# EAGLE design octapentaveega_v2 (EAGLE 7.4.0)
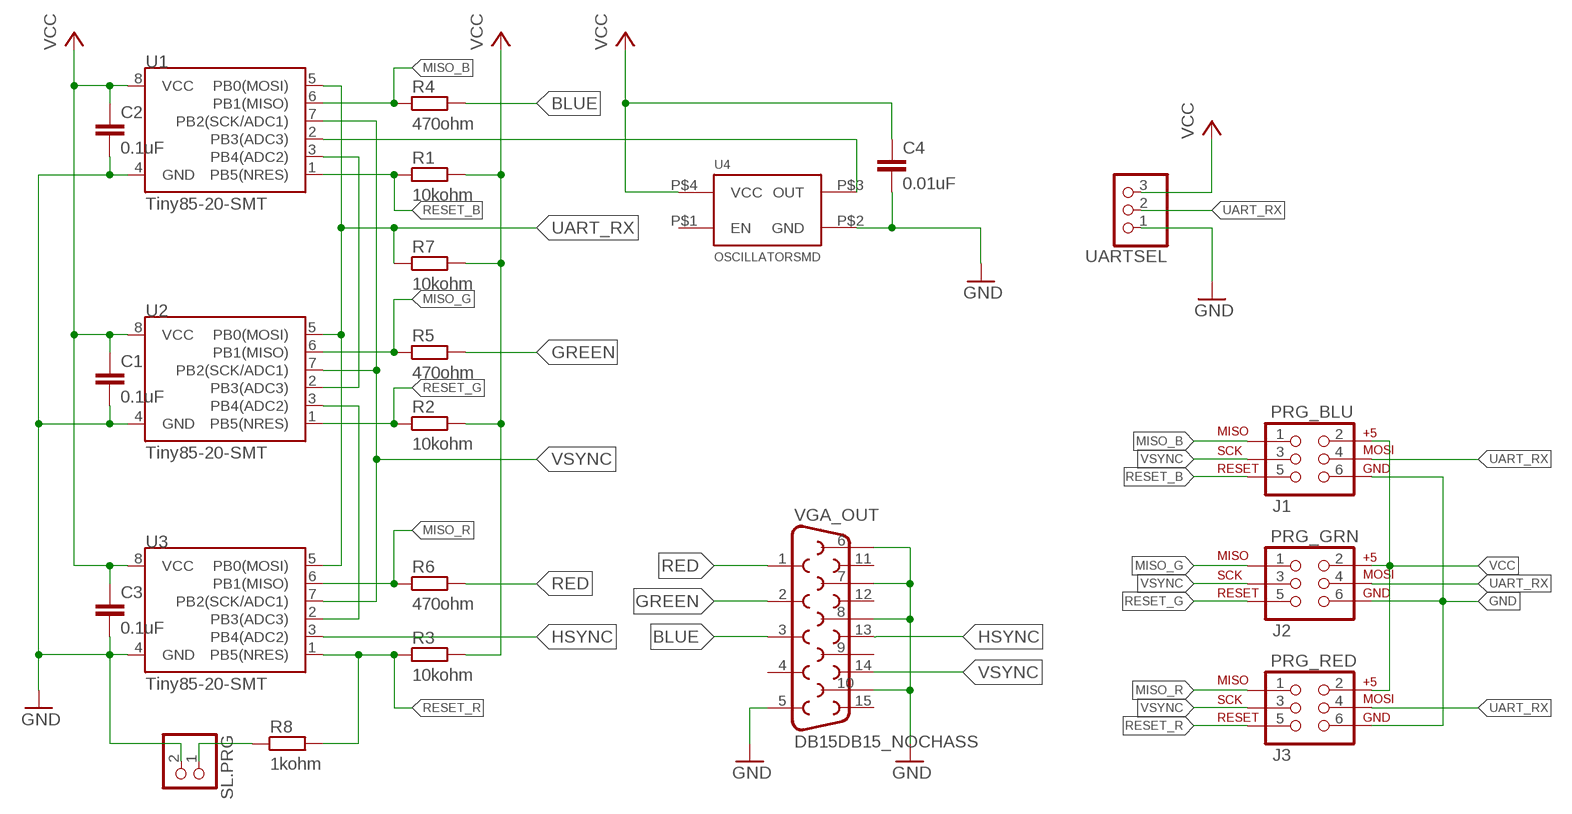
[diagram p0: schematic, sheet 1]

## Parts
C1  0.1uF  CAPACITOR  [C0603]
C2  0.1uF  CAPACITOR  [C0603]
C3  0.1uF  CAPACITOR  [C0603]
C4  0.01uF  CAPACITOR  [C0603]
PRG_BLU  J1  ISPTOUCH_HEADER  [AVX_9188_6-WAY_MATING_GUIDE]
PRG_GRN  J2  ISPTOUCH_HEADER  [AVX_9188_6-WAY_MATING_GUIDE]
PRG_RED  J3  ISPTOUCH_HEADER  [AVX_9188_6-WAY_MATING_GUIDE]
R1  10kohm  RESISTOR  [R0603]
R2  10kohm  RESISTOR  [R0603]
R3  10kohm  RESISTOR  [R0603]
R4  470ohm  RESISTOR  [R0603]
R5  470ohm  RESISTOR  [R0603]
R6  470ohm  RESISTOR  [R0603]
R7  10kohm  RESISTOR  [R0603]
R8  1kohm  RESISTOR  [R0603]
SL.PRG  PINHD-1X02_2.54-S  [1X02-S]
U1  Tiny85-20-SMT  ATTINY45TINY85-20-SMT  [SO08-EIAJ]
U2  Tiny85-20-SMT  ATTINY45TINY85-20-SMT  [SO08-EIAJ]
U3  Tiny85-20-SMT  ATTINY45TINY85-20-SMT  [SO08-EIAJ]
U4  OSCILLATORSMD  [CRYSTAL-SMD-7X5]
UARTSEL  PINHD-1X03_2.54-S  [1X03-S]
VGA_OUT  DB15DB15_NOCHASS  [DB15_NOCHASS]

## Nets
BLUE: R4.2 VGA_OUT.3
GND: C1.2 C2.2 C3.2 C4.2 PRG_BLU.6 PRG_GRN.6 PRG_RED.6 SL.PRG.2 U1.4(GND) U2.4(GND) U3.4(GND) U4.P$2(GND) UARTSEL.1 VGA_OUT.5 VGA_OUT.6 VGA_OUT.7 VGA_OUT.8 VGA_OUT.10
GREEN: R5.2 VGA_OUT.2
HSYNC: U3.3(PB4(ADC2)) VGA_OUT.13
MISO_B: PRG_BLU.1 R4.1 U1.6(PB1(MISO))
MISO_G: PRG_GRN.1 R5.1 U2.6(PB1(MISO))
MISO_R: PRG_RED.1 R6.1 U3.6(PB1(MISO))
N$1: U1.2(PB3(ADC3)) U4.P$3(OUT)
N$2: U1.3(PB4(ADC2)) U2.2(PB3(ADC3))
N$3: U2.3(PB4(ADC2)) U3.2(PB3(ADC3))
N$16: R8.1 SL.PRG.1
RED: R6.2 VGA_OUT.1
RESET_B: PRG_BLU.5 R1.1 U1.1(PB5(NRES))
RESET_G: PRG_GRN.5 R2.1 U2.1(PB5(NRES))
RESET_R: PRG_RED.5 R3.1 R8.2 U3.1(PB5(NRES))
UART_RX: PRG_BLU.4 PRG_GRN.4 PRG_RED.4 R7.1 U1.5(PB0(MOSI)) U2.5(PB0(MOSI)) U3.5(PB0(MOSI)) UARTSEL.2
VCC: C1.1 C2.1 C3.1 C4.1 PRG_BLU.2 PRG_GRN.2 PRG_RED.2 R1.2 R2.2 R3.2 R7.2 U1.8(VCC) U2.8(VCC) U3.8(VCC) U4.P$4(VCC) UARTSEL.3
VSYNC: PRG_BLU.3 PRG_GRN.3 PRG_RED.3 U1.7(PB2(SCK/ADC1)) U2.7(PB2(SCK/ADC1)) U3.7(PB2(SCK/ADC1)) VGA_OUT.14
Unconnected: U4.P$1(EN) VGA_OUT.4 VGA_OUT.9 VGA_OUT.11 VGA_OUT.12 VGA_OUT.15

## Library data of the parts
C1-C4 = BaseApp:CAPACITOR
PRG_BLU PRG_GRN PRG_RED = prg_header:ISPTOUCH: ISPtouch for AVR Microcontrollers This 6-pin ISP connector for AVR programming does not require any part on the PCB, but an adapter for a common 6-pin programmer.
R1-R8 = BaseApp:RESISTOR: Resistance Package :- 0603 Mount :-Surface mount
SL.PRG = pinhead-2:PINHD-1X02: PIN HEADER
U1-U3 = SparkFun-DigitalIC:ATTINY45: Atmel 8-pin 2/4/8kB flash uC; PROD_ID: IC-09092
U4 = SparkFun-FreqCtrl:OSCILLATOR: Generic 5x3 and 7x5 oscillators
UARTSEL = pinhead-2:PINHD-1X03: PIN HEADER
VGA_OUT = SparkFun-Connectors:DB15: DB15 / VGA right angle through-hole female connector.

## Board
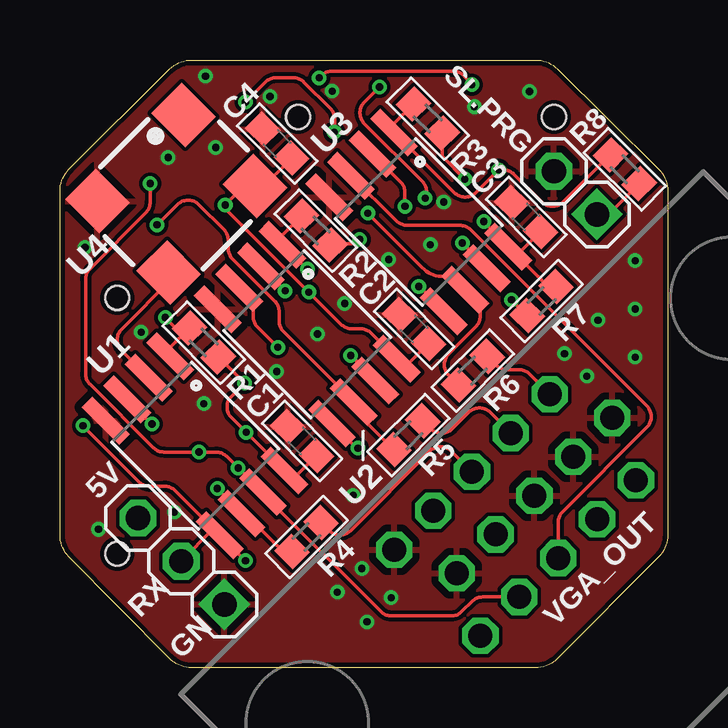
[diagram p1: board, top side]
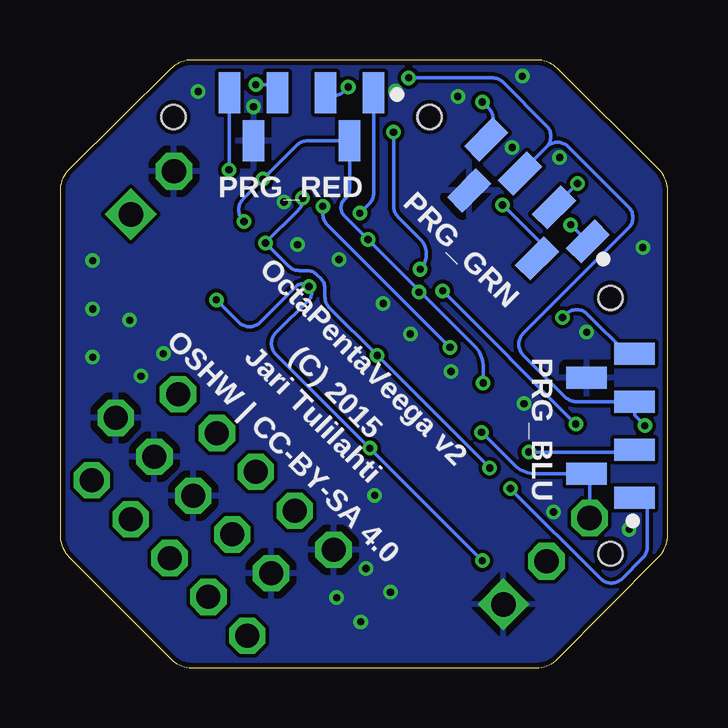
[diagram p2: board, bottom side, seen from below]

Size 25.32 x 25.32 mm. Coordinates in mm from the lower left corner, seen from the top.
Outline: 0.37,20.77 4.58,24.95 arc-45 5.48,25.32 19.82,25.32 arc-45 20.72,24.96 24.95,20.77 arc-45 25.32,19.87 25.32,5.53 arc-45 24.95,4.63 20.72,0.37 arc-45 19.82,0 5.48,0 arc-45 4.58,0.38 0.37,4.63 arc-45 0,5.53 0,19.87 arc-45 0.37,20.77
Copper layers (1*16): Top 0.035mm / dielectric 1.5mm / Bottom 0.035mm
Design rules "tagsu *": minimum track width 6mil, minimum drill 0.3mm, track to track 6mil, track to pad 6mil, pad to pad 6mil, via to via 6mil, smd to smd 0mil, copper to edge 0.2mm, drill to drill 0.2mm, minimum pad ring 10mil, minimum via ring 6mil, stop-mask expansion 2mil, vias tented up to drill 100mil, thermal gap 0.3mm

### Footprints (pad centres in the part's own frame; a part is rotated, then mirrored left to right if it is on the bottom)
C0603 = smd 1.1 x 1: 1 -0.85,0; 2 0.85,0
AVX_9188_6-WAY_MATING_GUIDE = smd 0.9 x 1.7: 1 -3,-1; 2 -2,1; 3 -1,-1; 4 1,-1; 5 3,-1; 6 2,1 | hole 1: -5.334,0; 5.334,0
R0603 = smd 1 x 1.1: 1 -0.85,0; 2 0.85,0
1X02-S = drill 1.016 square: 1 -1.27,0 | drill 1.016 octagon: 2 1.27,0
SO08-EIAJ = smd 0.61 x 2.21: 1 -1.905,-3.378; 2 -0.635,-3.378; 3 0.635,-3.378; 4 1.905,-3.378; 5 1.905,3.353; 6 0.635,3.353; 7 -0.635,3.353; 8 -1.905,3.353
CRYSTAL-SMD-7X5 = smd 1.8 x 2: P$1 -2.54,-2.1; P$2 2.54,-2.1; P$3 2.54,2.1; P$4 -2.54,2.1
1X03-S = drill 1.016 square: 1 -2.54,0 | drill 1.016 octagon: 2 0,0; 3 2.54,0
DB15_NOCHASS = drill 1 octagon: 1 -4.32,-7.62; 2 -2.03,-7.62; 3 0.26,-7.62; 4 2.55,-7.62; 5 4.84,-7.62; 6 -5.46,-5.08; 7 -3.17,-5.08; 8 -0.88,-5.08; 9 1.41,-5.08; 10 3.7,-5.08; 11 -4.32,-2.54; 12 -2.03,-2.54; 13 0.26,-2.54; 14 2.55,-2.54; 15 4.84,-2.54

### Placement (x,y rotation side)
C1  10.09,9.45 135 top
C2  14.76,14.12 135 top
C3  19.43,18.78 135 top
C4  9.05,21.84 135 top
PRG_BLU  2.38,10.09 90 bottom
PRG_GRN  6.16,19.18 135 bottom
PRG_RED  15.25,22.95 180 bottom
R1  5.99,13.55 315 top
R2  10.66,18.22 315 top
R3  15.32,22.88 315 top
R4  10.27,5.45 45 top
R5  14.51,9.69 45 top
R6  17.2,12.38 45 top
R7  20.07,15.28 45 top
R8  23.53,20.77 135 top
SL.PRG  21.47,19.79 135 top
U1  5.64,9.25 225 top
U2  10.31,13.89 225 top
U3  14.96,18.57 225 top
U4  4.84,19.76 225 top
UARTSEL  5.05,4.44 135 top
VGA_OUT  22.74,2.96 225 top

### Tracks (layer width: path | path; a pad name or v marks a point on that pad's centre or on a via)
BLUE
  Top 0.152: R4.2 11.21,5.72 arc90 12.11,5.72 15.41,9.02 arc-90 16.31,9.02 VGA_OUT.3
GND  (via drill 0.3)
  Top 0.152: U3.4 10.69,20.16
  Bottom 0.152: 8.4,19.77 PRG_GRN.6
  other vias: 23.96,16.96 23.96,14.95 23.96,12.94 11.55,3.15 12.79,1.91 12.58,4.14 13.8,2.92 21.95,12.15 21.02,13.08 22.42,14.49 15.99,19.41 17.26,23.38 3.38,13.98 6.06,24.65 8.75,23.8 9.03,12.35 5.99,11 4.51,21.26 6.48,21.68 1.04,17.51 12.21,7.19 10.73,13.9 19.57,24.02 1.61,5.77 11.34,24.02 13.7,17.01 11.86,15.18 4.76,6.49 15.43,17.63
  pour Top: 4.93,0.05 0,4.98 0,8.64 0,20.35 5,25.35 14.53,25.35 20.35,25.35 25.35,20.35 25.35,9.37 25.35,5.05 20.35,0.05
  pour Bottom: 4.93,0.05 0,4.98 0,8.64 0,20.35 5,25.35 14.53,25.35 20.35,25.35 25.35,20.35 25.35,9.37 25.35,5.05 20.35,0.05
GREEN
  Top 0.152: R5.2 15.45,9.96 arc90 16.35,9.96 17.03,10.64 arc-90 17.93,10.64 VGA_OUT.2
HSYNC
  Top 0.152: VGA_OUT.13 20.76,6.06 arc-45 20.94,6.51 24.45,10.01 arc90 24.45,10.91 17.11,18.25 arc45 16.66,18.44 14.47,18.44 arc-45 14.02,18.62 U3.3
MISO_B  (via drill 0.3)
  Top 0.152: 7.56,6.14 U1.6 | U1.6 8,5.97 8.16,5.97 9.28,4.85 R4.1 | v6.56,7.47 7.56,6.47 U1.6
  Bottom 0.152: v6.56,7.47 2.8,3.71 arc-90 1.9,3.71 1.03,4.58 arc-45 0.85,5.03 0.85,6.96 0.97,7.09 PRG_BLU.1
MISO_G  (via drill 0.3)
  Top 0.152: R5.1 12.22,10.78 U2.6 9.31,13.99 arc-45 9.13,14.44 9.13,14.83 arc45 8.94,15.28 7.19,17.03 arc-45 7.01,17.48 7.01,17.81 arc45 6.82,18.26 5.79,19.3 arc90 4.89,19.3 v4.05,18.46
  Bottom 0.152: PRG_GRN.1 3.38,17.79 v4.05,18.46
MISO_R  (via drill 0.3)
  Top 0.152: R6.1 16.2,12.18 arc-90 16.2,13.08 17.32,14.2 arc45 17.51,14.65 17.51,14.84 17.46,14.88 17.46,15.18 U3.6 arc-45 16.63,15.86 16.19,16.3 15.99,16.3 arc-45 15.1,16.67 v12.83,18.94
  Bottom 0.152: PRG_RED.1 12.25,19.78 arc45 12.44,19.33 v12.83,18.94
N$1
  Top 0.152: U1.2 2.57,13.2 arc-90 2.57,14.1 4.66,16.2 U4.P$3 | 4.83,15.87 4.83,16.31 U4.P$3 | 4.74,16.28 U4.P$3
N$2  (via drill 0.3)
  Top 0.152: U1.3 v3.83,10.16 | v9.38,15.71 9.31,15.8 U2.2
  Bottom 0.152: v3.83,10.16 v9.38,15.71
N$3  (via drill 0.3)
  Top 0.152: U3.2 14.19,20.25 arc-45 14.37,19.8 v14.37,19.23 | v9.07,13.35 8.24,14.19 arc-45 8.05,14.64 8.05,15.28 7.48,15.84 U2.3
  Bottom 0.152: v14.37,19.23 14.37,18.92 arc-45 14.19,18.47 v9.07,13.35
N$16
  Top 0.152: R8.1 22.84,18.88 22.39,18.88 SL.PRG.1
RED
  Top 0.152: VGA_OUT.1 19.57,12.24 arc45 19.12,12.42 18.62,12.42 arc-45 18.18,12.61 R6.2
RESET_B  (via drill 0.3)
  Top 0.152: U1.1 4.59,13.36 R1.1 4.83,14.15 v4.39,14.59
  Bottom 0.152: 1.87,13.41 1.63,13.34 PRG_BLU.5 arc90 1.69,13.09 3.34,14.74 arc-90 4.24,14.74 v4.39,14.59
RESET_G  (via drill 0.3)
  Top 0.152: R2.1 9.26,18.02 U2.1 10.3,16.61 v10.31,16.61 | v11.43,22.32 11.45,22.33 11.45,22.86 arc45 11.26,23.31 10.17,24.4 arc45 9.72,24.59 9.01,24.59 arc45 8.56,24.4 v7.73,23.57
  Bottom 0.152: v10.31,16.61 arc-90 10.31,17.86 11.24,18.79 arc45 11.43,19.24 v11.43,22.32 | v7.73,23.57 7.46,23.31 arc45 7.28,22.86 7.28,22.69 7.55,22.43 PRG_GRN.5
RESET_R  (via drill 0.3)
  Top 0.152: R8.2 20.97,19.41 arc-90 20.07,19.41 18.92,20.56 arc45 18.47,20.75 v18.28,20.75 17.33,19.8 arc-90 16.43,19.8 U3.1 13.93,22.69 R3.1
  Bottom 0.152: PRG_RED.5 18.28,23.93 v18.28,20.75
UART_RX  (via drill 0.3)
  Top 0.152: 16.01,14.86 U3.5 14.96,15.89 v14.95,15.89 | U1.5 v7.72,4.46 v7.73,4.46 | U2.5 12.39,9.12 v12.41,9.15 | 6.62,5.56 U1.5 | UARTSEL.2 6.4,5.78 U1.5 | v0.96,10.09 3.28,7.76 arc45 3.73,7.57 4.34,7.57 arc-45 4.79,7.38 U1.5 | R7.1 v18.81,15.33 | v10.8,24.58 10.89,24.68 arc-45 11.35,24.86 16.4,24.85 arc-49 16.87,24.63 v17.16,24.3
  Bottom 0.152: v7.73,4.46 v12.41,9.15 16.33,13.06 arc90 16.33,13.96 14.95,15.34 arc-90 v14.95,15.89 arc-90 15.49,15.89 16.98,14.4 arc90 17.87,14.4 v18.81,15.33 | v0.96,10.09 1.38,10.51 PRG_BLU.4 3.81,11.09 arc45 4.26,11.27 6.02,13.03 arc90 6.02,13.93 1.64,18.31 arc-90 1.64,19.21 4.14,21.71 arc-90 5.04,21.71 PRG_GRN.4 5.06,21.69 arc-90 5.06,22.59 6.86,24.4 arc-45 7.31,24.58 v10.8,24.58 | v17.16,24.3 16.6,24.3 PRG_RED.4
VCC  (via drill 0.3)
  Top 0.152: C2.1 14.37,12.53 | 9.71,7.86 C1.1 | C3.1 19.04,17.2 20.35,15.88 R7.2 | U2.8 12.96,13.94 arc45 12.51,14.13 12.16,14.13 arc-45 11.71,14.31 v10.37,15.65 6.81,19.21 v6.89,19.28 8.07,20.47 8.55,20 | U3.8 17.66,18.58 | R2.2 11.31,17.66 12.05,17.66 arc45 v12.49,17.84 | v16.87,20.36 15.92,21.3 R3.2 | R1.2 v7.69,11.86 7.15,11.32 arc90 7.15,10.42 v7.76,9.81 U1.8 | 8.3,19.75 U4.P$4 8.3,19.89 C4.1
  Top 0.305: 14.37,12.53 U2.8 | C3.1 | U1.8 9.71,7.86 | U3.8 19.04,17.2 | 17.66,18.58 v17.66,18.6 | 8.55,20 U4.P$4
  Bottom 0.152: 10.35,15.71 v12.49,17.84 13.47,18.83 arc90 13.47,19.51 13.44,19.55 arc-45 13.25,20 PRG_RED.2 | 10.35,15.71 8.06,13.42 arc45 7.69,12.52 v7.69,11.86 | PRG_RED.2 13.41,21.95 | PRG_GRN.2 5.28,17.23 5.28,17.68 v6.89,19.28 | UARTSEL.3 3.26,7.78 arc-45 PRG_BLU.2 5.51,8.09 arc45 6.4,8.46 v7.76,9.81 | PRG_RED.2 15.01,21.95 arc-45 15.46,21.77 v16.87,20.36 17.7,19.53 arc-90 17.7,18.63 v17.66,18.6 | v10.37,15.65 10.37,15.66 arc45 10.35,15.71
VSYNC  (via drill 0.3)
  Top 0.152: 17.8,16.66 U3.7 17.79,16.67 v16.76,17.7 | v12.11,13.01 13.13,11.99 U2.7 | v3.76,20.18 3.76,19.4 arc-45 3.57,18.95 1.25,16.63 arc45 1.06,16.18 1.06,12.25 arc45 1.25,11.8 3.88,9.18 arc45 4.33,8.99 v5.79,8.99 6.49,8.99 arc-45 6.94,8.8 v7.42,8.33 7.43,8.34 U1.7 8.46,7.26 13.37,2.35 arc45 13.81,2.16 16.3,2.16 arc45 16.75,2.35 17.17,2.77 arc-45 17.62,2.95 VGA_OUT.14 | v13.31,24.2 12.68,23.57 arc90 12.68,22.68 15.09,20.27 arc-45 15.28,19.82 15.28,19.63 v15.22,19.57
  Bottom 0.152: v7.42,8.33 v12.11,13.01 14.1,15 arc45 14.28,15.45 14.28,15.79 arc-45 14.47,16.23 14.6,16.37 arc-45 15.05,16.55 15.35,16.55 arc45 15.8,16.74 v16.76,17.7 15.4,19.06 arc-45 15.22,19.51 v15.22,19.57 | PRG_BLU.3 1.48,8.99 v5.79,8.99 | PRG_GRN.3 4.72,19.22 v3.76,20.18 | PRG_RED.3 14.13,23.83 13.95,23.83 arc-45 13.5,24.02 v13.31,24.2

### Text on the board
tPlace: 5V | RX / GN
bPlace: OctaPentaVeega v2 | (C) 2015 / Jari Tulilahti | OSHW | CC-BY-SA 4.0